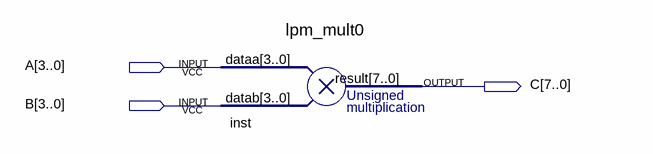
[diagram p0: schematic sheet]
// Quartus schematic mult_sch.bdf as structural Verilog: 1 symbols, 3 pins
module mult_sch (
  input  [3:0] A,
  input  [3:0] B,
  output [7:0] C
);

  lpm_mult0 inst (.dataa(A), .datab(B), .result(C));
endmodule
